# Altium schematic sheet main.SchDoc
size A4
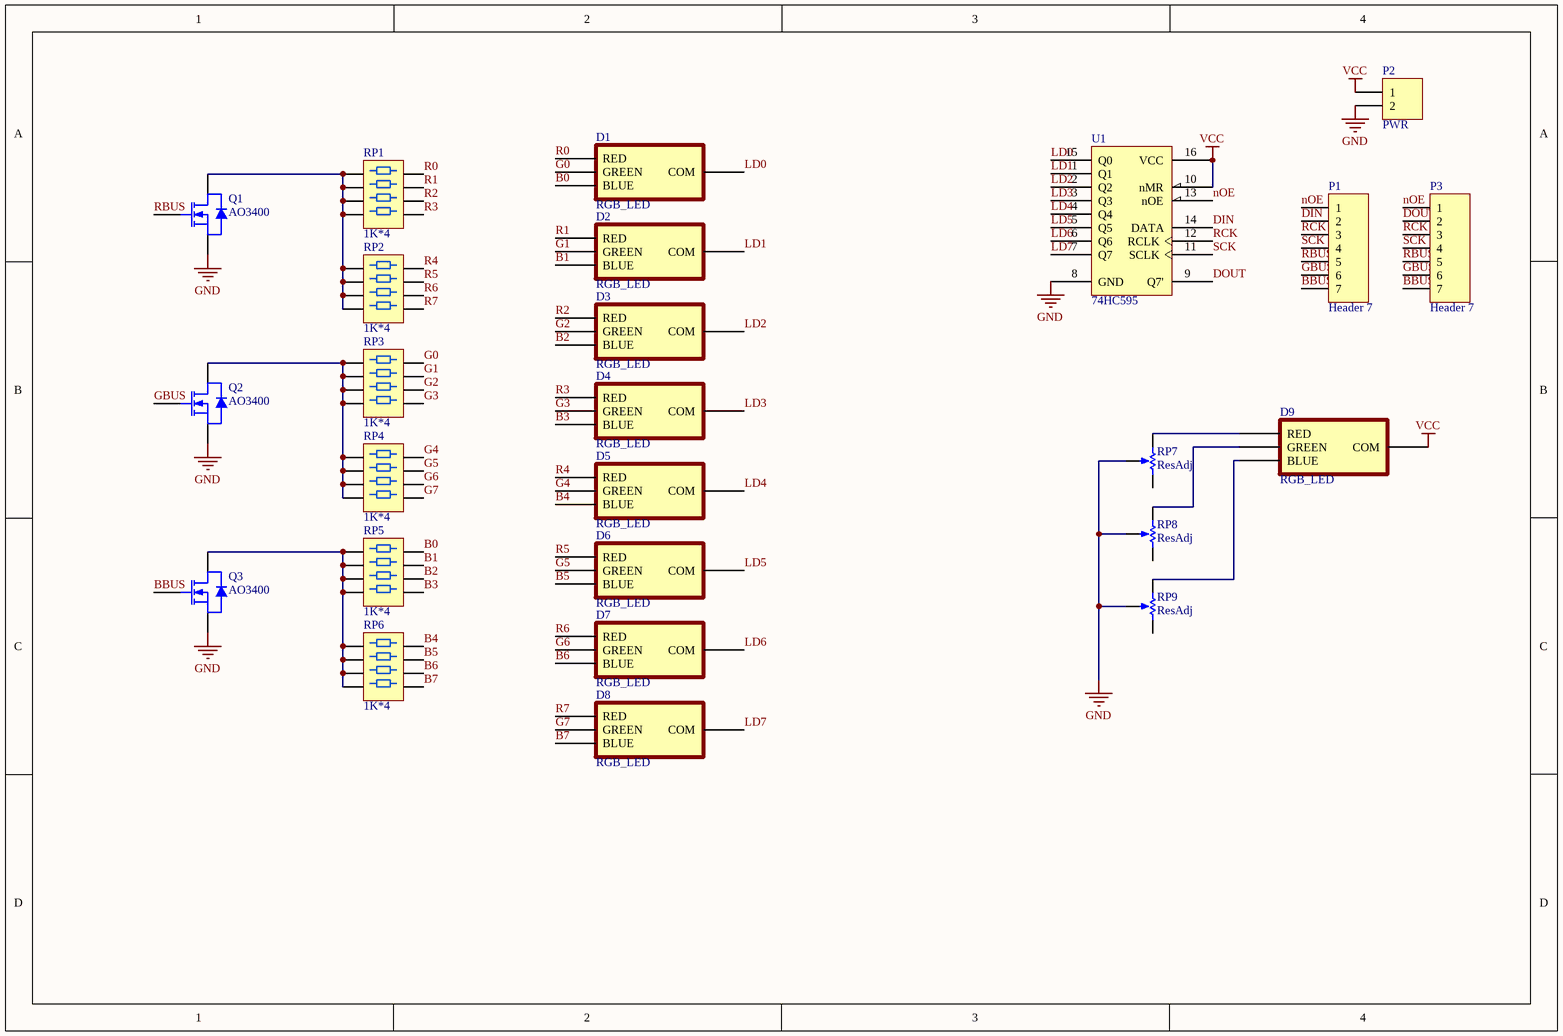
[diagram p0: main.SchDoc]

## Parts
D1  RGB_LED  [0805_RGB]
D2  RGB_LED  [0805_RGB]
D3  RGB_LED  [0805_RGB]
D4  RGB_LED  [0805_RGB]
D5  RGB_LED  [0805_RGB]
D6  RGB_LED  [0805_RGB]
D7  RGB_LED  [0805_RGB]
D8  RGB_LED  [0805_RGB]
D9  RGB_LED  [0805_RGB]
P1  Header 7  [HDR1X7]
P2  PWR  [HDR1X2]
P3  Header 7  [HDR1X7]
Q1  AO3400  [SOT-23]
Q2  AO3400  [SOT-23]
Q3  AO3400  [SOT-23]
RP1  1K*4  [0603x4]
RP2  1K*4  [0603x4]
RP3  1K*4  [0603x4]
RP4  1K*4  [0603x4]
RP5  1K*4  [0603x4]
RP6  1K*4  [0603x4]
RP7  ResAdj  [RP_POT]
RP8  ResAdj  [RP_POT]
RP9  ResAdj  [RP_POT]
U1  74HC595  [TSSOP16]

## Nets
GND: P2.2 Q1.2(S) Q2.2(S) Q3.2(S) RP7.2(TAP) RP8.2(TAP) RP9.2(TAP) U1.8(GND)
VCC: D9.COM P2.1 U1.10(nMR) U1.16(VCC)
B0: D1.B(BLUE) RP5.8
B1: D2.B(BLUE) RP5.7
B2: D3.B(BLUE) RP5.6
B3: D4.B(BLUE) RP5.5
B4: D5.B(BLUE) RP6.8
B5: D6.B(BLUE) RP6.7
B6: D7.B(BLUE) RP6.6
B7: D8.B(BLUE) RP6.5
BBUS: P1.7 P3.7 Q3.1(G)
DIN: P1.2 U1.14(DATA)
DOUT: P3.2 U1.9(Q7')
G0: D1.G(GREEN) RP3.8
G1: D2.G(GREEN) RP3.7
G2: D3.G(GREEN) RP3.6
G3: D4.G(GREEN) RP3.5
G4: D5.G(GREEN) RP4.8
G5: D6.G(GREEN) RP4.7
G6: D7.G(GREEN) RP4.6
G7: D8.G(GREEN) RP4.5
GBUS: P1.6 P3.6 Q2.1(G)
LD0: D1.COM U1.15(Q0)
LD1: D2.COM U1.1(Q1)
LD2: D3.COM U1.2(Q2)
LD3: D4.COM U1.3(Q3)
LD4: D5.COM U1.4(Q4)
LD5: D6.COM U1.5(Q5)
LD6: D7.COM U1.6(Q6)
LD7: D8.COM U1.7(Q7)
nOE: P1.1 P3.1 U1.13(nOE)
R0: D1.R(RED) RP1.8
R1: D2.R(RED) RP1.7
R2: D3.R(RED) RP1.6
R3: D4.R(RED) RP1.5
R4: D5.R(RED) RP2.8
R5: D6.R(RED) RP2.7
R6: D7.R(RED) RP2.6
R7: D8.R(RED) RP2.5
RBUS: P1.5 P3.5 Q1.1(G)
RCK: P1.3 P3.3 U1.12(RCLK)
SCK: P1.4 P3.4 U1.11(SCLK)
NetD9_B: D9.B(BLUE) RP9.1(TOP)
NetD9_G: D9.G(GREEN) RP8.1(TOP)
NetD9_R: D9.R(RED) RP7.1(TOP)
NetQ1_3: Q1.3(D) RP1.1 RP1.2 RP1.3 RP1.4 RP2.1 RP2.2 RP2.3 RP2.4
NetQ2_3: Q2.3(D) RP3.1 RP3.2 RP3.3 RP3.4 RP4.1 RP4.2 RP4.3 RP4.4
NetQ3_3: Q3.3(D) RP5.1 RP5.2 RP5.3 RP5.4 RP6.1 RP6.2 RP6.3 RP6.4

Not connected (* = marked no-connect by the designer): RP7 3(BOT); RP8 3(BOT); RP9 3(BOT)

## Library data of the parts
D1-D9 = RGBLED
P1 P3 = Header 7: Header, 7-Pin; LatestRevisionDate: 17-Jul-2002; LatestRevisionNote: Re-released for DXP Platform.; Publisher: Altium Limited
P2 = Header 2: Header, 2-Pin; LatestRevisionDate: 17-Jul-2002; LatestRevisionNote: Re-released for DXP Platform.; Publisher: Altium Limited
Q1-Q3 = AO3400: N-Channel MOSFET; Published: 8-Jun-2000; Revision: July-2002: Re-released for DXP Platform.; Publisher: Altium Limited
RP1-RP6 = RPack_4
RP7-RP9 = RPot: Potentiometer; Sim Note: Enter the Resistance value and the set point into parameter fields.; Set Position: 0.5; Value: 1K; Published: 8-Jun-2000; LatestRevisionDate: 17-Jul-2002; LatestRevisionNote: Re-released for DXP Platform.; PackageReference: VR5; Publisher: Altium Limited; PackageDescription: Variable Resistor, Thru-Hole; 3 Leads
U1 = 74HC595: 8-bit serial-in, serial or parallel-out shift register with output latches; 3-state